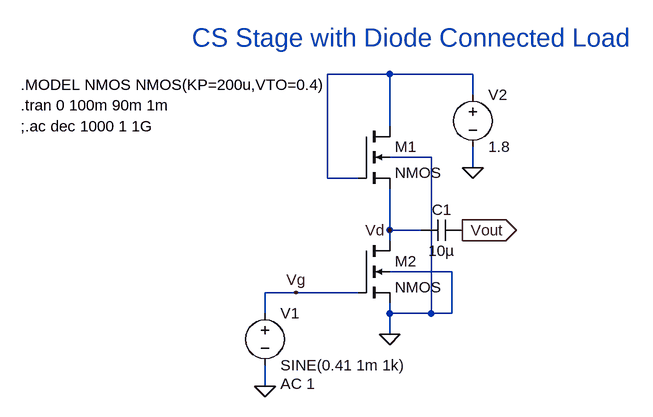
[diagram p0: schematic CS_Amplifier_Diode_Connected_Load.asc]
CS_Amplifier_Diode_Connected_Load.asc, the LTspice schematic file:
Version 4
SHEET 1 880 680
WIRE 192 32 96 32
WIRE 320 32 192 32
WIRE 320 64 320 32
WIRE 192 112 192 32
WIRE 256 160 192 160
WIRE 320 176 320 144
WIRE 96 192 96 32
WIRE 144 192 96 192
WIRE 192 272 192 208
WIRE 240 272 192 272
WIRE 192 288 192 272
WIRE 288 336 192 336
WIRE 48 368 0 368
WIRE 144 368 48 368
WIRE 0 400 0 368
WIRE 192 400 192 384
WIRE 256 400 256 160
WIRE 256 400 192 400
WIRE 288 400 288 336
WIRE 288 400 256 400
WIRE 192 432 192 400
WIRE 0 512 0 480
FLAG 192 432 0
FLAG 320 176 0
FLAG 0 512 0
FLAG 304 272 Vout
IOPIN 304 272 Out
FLAG 192 272 Vd
FLAG 48 368 Vg
SYMBOL nmos4 144 288 R0
SYMATTR InstName M2
SYMATTR Value2 l=1u w=1m
SYMBOL voltage 0 384 R0
WINDOW 123 24 124 Left 2
WINDOW 39 0 0 Left 0
SYMATTR Value2 AC 1
SYMATTR InstName V1
SYMATTR Value SINE(0.41 1m 1k)
SYMBOL voltage 320 48 R0
WINDOW 123 0 0 Left 0
WINDOW 39 0 0 Left 0
SYMATTR InstName V2
SYMATTR Value 1.8
SYMBOL nmos4 144 112 R0
SYMATTR InstName M1
SYMATTR Value2 l=1u w=1u
SYMBOL cap 304 256 R90
WINDOW 0 0 32 VBottom 2
WINDOW 3 32 32 VTop 2
SYMATTR InstName C1
SYMATTR Value 10µ
TEXT -376 80 Left 2 !.tran 0 100m 90m 1m
TEXT -376 48 Left 2 !.MODEL NMOS NMOS(KP=200u,VTO=0.4)
TEXT -112 -24 Left 4 ;CS Stage with Diode Connected Load
TEXT -376 112 Left 2 !;.ac dec 1000 1 1G

The netlist it stands for:
* CS_Amplifier_Diode_Connected_Load.asc
M2 Vd Vg 0 0 NMOS l=1u w=1m
V1 Vg 0 SINE(0.41 1m 1k) AC 1
V2 N001 0 1.8
M1 N001 N001 Vd 0 NMOS l=1u w=1u
C1 Vout Vd 10µ
.model NMOS NMOS
.model PMOS PMOS
.lib standard.mos
.tran 0 100m 90m 1m
.MODEL NMOS NMOS(KP=200u,VTO=0.4)
* CS Stage with Diode Connected Load
;.ac dec 1000 1 1G
.backanno
.end